# EAGLE design uv-dosimeter-featherwing-mk-2.1 (EAGLE 7.5.0)
AUTHOR: sean@yak.net
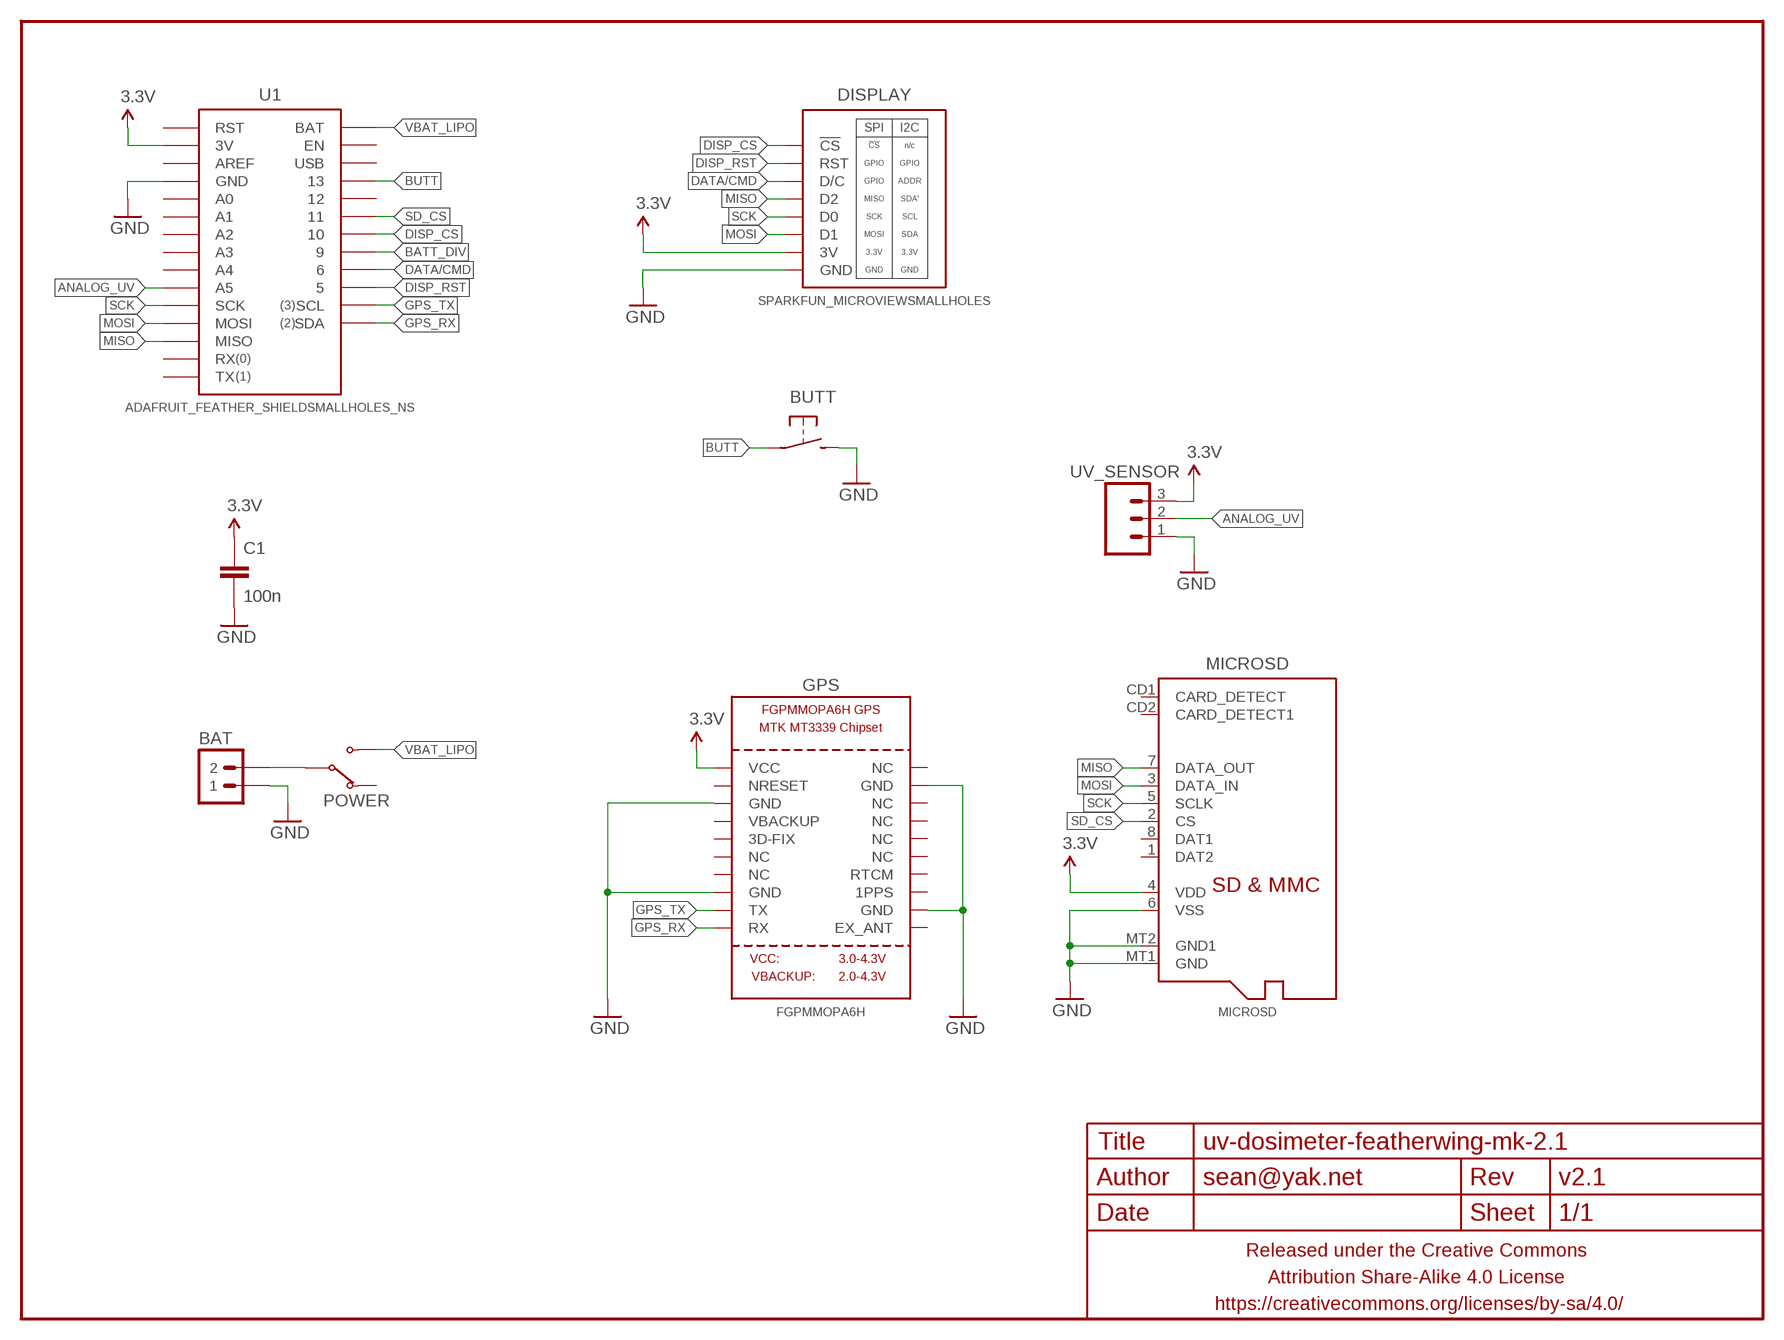
[diagram p0: schematic, sheet 1]

## Parts
BAT  M02JST-2MM-SMT  [JST-2-SMD]
BUTT  SPST-NO-TACT3MM-PTH-SMALL-PADS  [DTS-3-SMALL-PADS]
C1  100n  CAPACITOR-CERAMICC0603  [C0603]
DISPLAY  SPARKFUN_MICROVIEWSMALLHOLES  [SPARKFUN-MICROVIEW-SMALLHOLES]
FRAME1  FRAME-LETTERNO_PACKAGE  [DUMMY]
GPS  FGPMMOPA6H  GPS_FGPMMOPA6H  [FGPMMOPA6H]
MICROSD  MICROSD  [MICROSD]
POWER  SWITCH-SPDTPTH-VERT-2.54MM  [SWITCH-SPDT]
U1  ADAFRUIT_FEATHER_SHIELDSMALLHOLES_NS  [ADAFRUIT_FEATHER_SMALLHOLES_NS]
UV_SENSOR  M03PTH-CENTERED  [1X03-CENTERED]

## Nets
3.3V: C1.1 DISPLAY.3V GPS.P$1(VCC) MICROSD.4(VDD) U1.3V UV_SENSOR.3
ANALOG_UV: U1.A5 UV_SENSOR.2
BATT_DIV: U1.9
BUTT: BUTT.1 U1.13
DATA/CMD: DISPLAY.D/C U1.6
DISP_CS: DISPLAY.CS(!CS) U1.10
DISP_RST: DISPLAY.RST U1.5
GND: BAT.2 BUTT.2 C1.2 DISPLAY.GND GPS.P$3(GND) GPS.P$8(GND) GPS.P$12(GND) GPS.P$19(GND) MICROSD.6(VSS) MICROSD.MT1(GND) MICROSD.MT2(GND1) U1.GND@0(GND) U1.GND@1(GND) UV_SENSOR.1
GPS_RX: GPS.P$10(RX) U1.SDA
GPS_TX: GPS.P$9(TX) U1.SCL
MISO: DISPLAY.D2 MICROSD.7(DATA_OUT) U1.MISO
MOSI: DISPLAY.D1 MICROSD.3(DATA_IN) U1.MOSI
N$2: BAT.1 POWER.2(COM)
SCK: DISPLAY.D0 MICROSD.5(SCLK) U1.SCK
SD_CS: MICROSD.2(CS) U1.11
VBAT_LIPO: POWER.3(NO) U1.BAT
Unconnected: GPS.P$2(NRESET) GPS.P$4(VBACKUP) GPS.P$5(3D-FIX) GPS.P$6(NC) GPS.P$7(NC) GPS.P$11(EX_ANT) GPS.P$13(1PPS) GPS.P$14(RTCM) GPS.P$15(NC) GPS.P$16(NC) GPS.P$17(NC) GPS.P$18(NC) GPS.P$20(NC) MICROSD.1(DAT2) MICROSD.8(DAT1) MICROSD.CD1(CARD_DETECT) MICROSD.CD2(CARD_DETECT1) POWER.1(NC) U1.12 U1.A0 U1.A1 U1.A2 U1.A3 U1.A4 U1.AREF U1.EN U1.RST U1.RX U1.TX U1.USB

## Library data of the parts
BAT = a_parts:M02: Standard 2-pin 0.1" header. Use with - straight break away headers ( PRT-00116) - right angle break away headers (PRT-00553) - swiss pins (PRT-00743) - machine pins (PRT-00117) - female headers (PRT-00115) Molex polarized connector foot print use with: PRT-08233 with associated crimp pins and housings. 2.54_SCREWTERM for use with PRT-10571. 3.5mm Screw Terminal footprints for PRT-08084 5mm Screw Terminal footprints for use with PRT-08433; PROD_ID: CONN-08352
BUTT = a_parts:SPST-NO-TACT
C1 = a_parts:CAPACITOR-CERAMIC: CAPACITOR, European symbol
DISPLAY = a_parts:SPARKFUN_MICROVIEW
FRAME1 = A_butts:FRAME-LETTER: Schematic Frame Standard 8.5x11 US Letter frame; DESIGNER: sean@yak.net; VERSION: v2.1
GPS = a_parts:GPS_FGPMMOPA6H: GPS Module - MTK MT3339 Chipset, -165dBm sensitivity, 22 channels, 10Hz, auto-select external antenna options
MICROSD = a_parts:MICROSD: Micro-SD / Transflash card holder with SPI pinout For the 3M # 2908-05WB-MG and/or 4UCON #19656 push-push type
POWER = a_parts:SWITCH-SPDT
U1 = a_parts:ADAFRUIT_FEATHER_SHIELD
UV_SENSOR = a_parts:M03: Header 3 Standard 3-pin 0.1" header. Use with straight break away headers (SKU : PRT-00116), right angle break away headers (PRT-00553), swiss pins (PRT-00743), machine pins (PRT-00117), and female headers (PRT-00115). Molex polarized connector foot print use with SKU : PRT-08232 with associated crimp pins and housings.

## Board
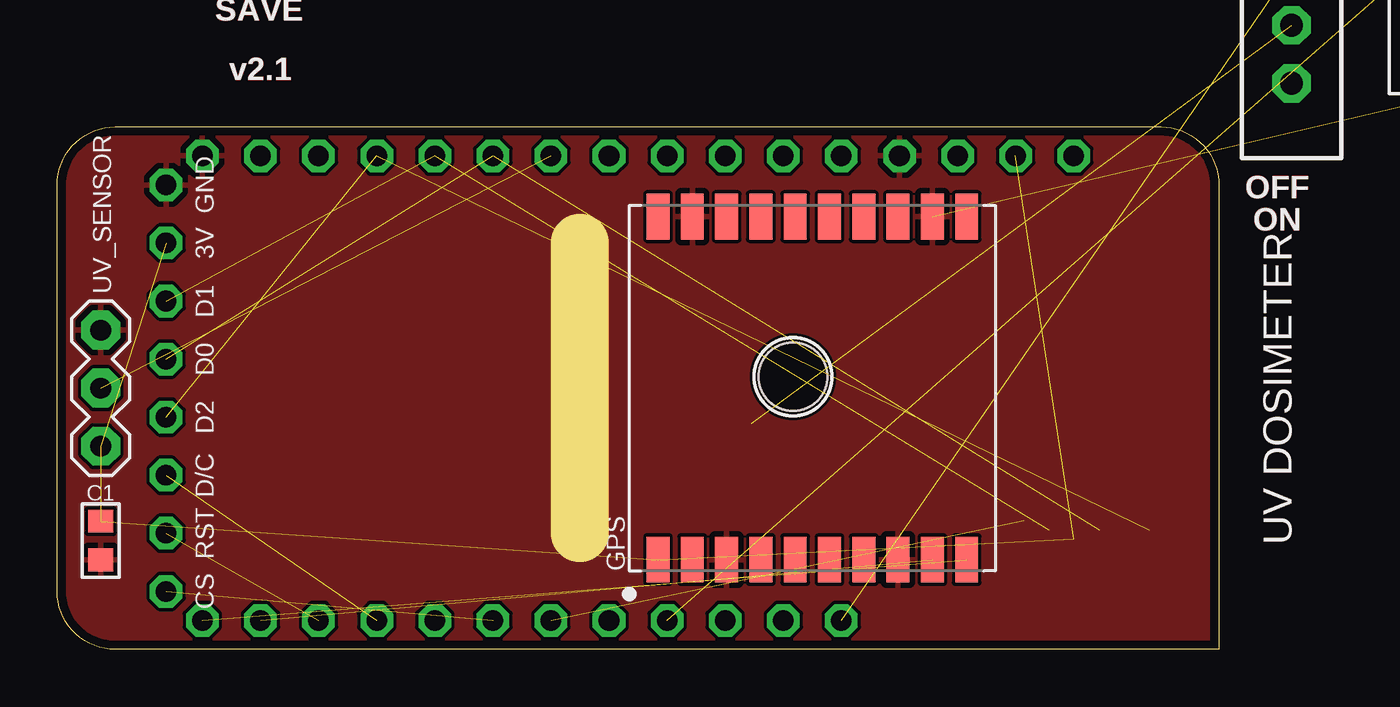
[diagram p1: board, top side]
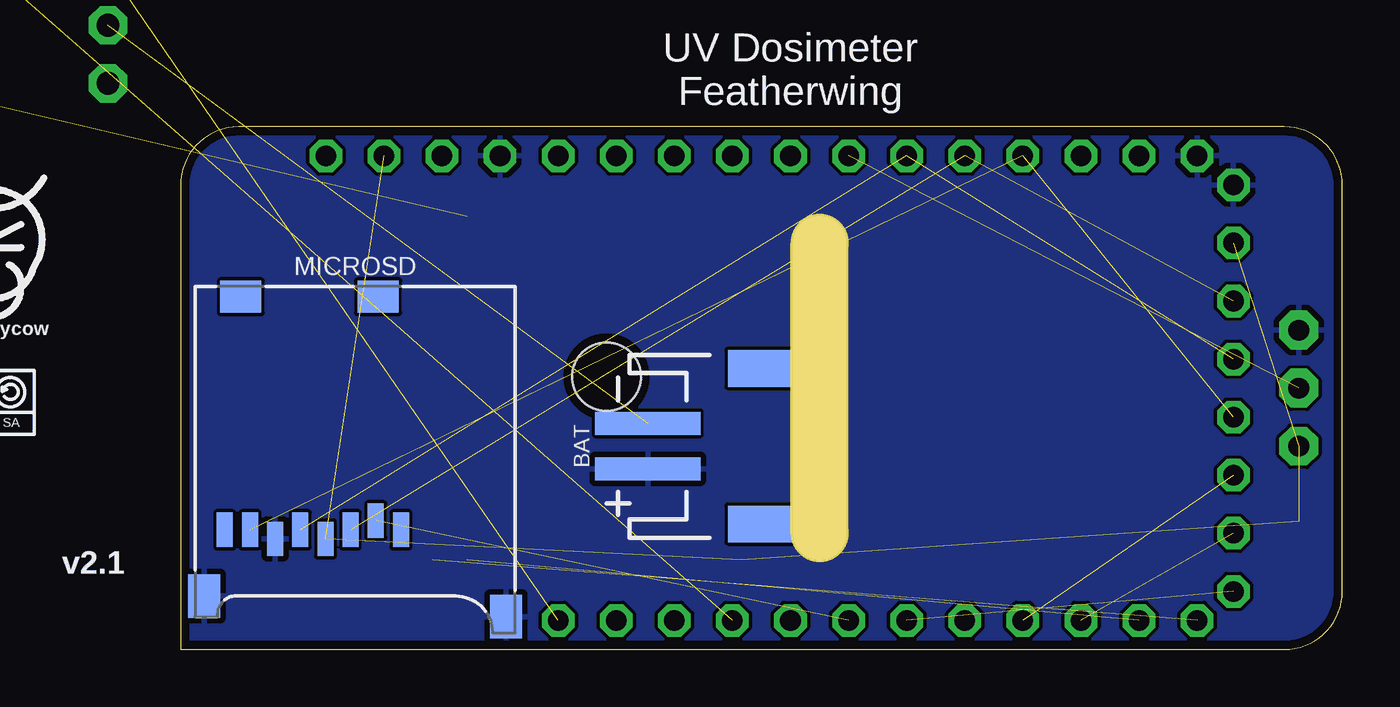
[diagram p2: board, bottom side, seen from below]

Size 50.8 x 22.86 mm. Coordinates in mm from the lower left corner, seen from the top.
Outline: 50.8,20.32 50.8,0 2.54,0 arc-90 0,2.54 0,20.32 arc-90 2.54,22.86 48.26,22.86 arc-90 50.8,20.32
Copper layers (1*16): Top 0.0356mm / dielectric 1.5011mm / Bottom 0.0356mm
Design rules "LaenPCBOrder_2": minimum track width 6mil, minimum drill 13mil, track to track 6mil, track to pad 6mil, pad to pad 6mil, via to via 6mil, smd to smd 6mil, copper to edge 15mil, drill to drill 6mil, minimum pad ring 7mil, minimum via ring 7mil, stop-mask expansion 3mil, vias tented up to drill 20mil, thermal gap 10mil
Milling: 1 lines

### Footprints (pad centres in the part's own frame; a part is rotated, then mirrored left to right if it is on the bottom)
JST-2-SMD = smd 1 x 4.6: 1 -1,-3.7; 2 1,-3.7 | smd 1.6 x 3.4: NC1 -3.4,1.5; NC2 3.4,1.5
DTS-3-SMALL-PADS = drill 1.3 pad 2: 1 -3.25,0; 2 3.25,0
C0603 = smd 1 x 1.1: 1 -0.85,0; 2 0.85,0
SPARKFUN-MICROVIEW-SMALLHOLES = drill 0.9 pad 1.422 octagon: 3V 6.35,8.89; CS -8.89,8.89; D0 1.27,8.89; D1 3.81,8.89; D2 -1.27,8.89; D/C -3.81,8.89; GND 8.89,8.89; RST -6.35,8.89
FGPMMOPA6H = smd 2 x 1: P$1 -7.5,6.75; P$2 -7.5,5.25; P$3 -7.5,3.75; P$4 -7.5,2.25; P$5 -7.5,0.75; P$6 -7.5,-0.75; P$7 -7.5,-2.25; P$8 -7.5,-3.75; P$9 -7.5,-5.25; P$10 -7.5,-6.75; P$11 7.5,-6.75; P$12 7.5,-5.25; P$13 7.5,-3.75; P$14 7.5,-2.25; P$15 7.5,-0.75; P$16 7.5,0.75; P$17 7.5,2.25; P$18 7.5,3.75; P$19 7.5,5.25; P$20 7.5,6.75 | hole 3: 0.5,0.85
MICROSD = smd 0.7 x 1.5: 1 9,-10.64; 2 7.9,-10.24; 3 6.8,-10.64; 4 5.7,-11.04; 5 4.6,-10.64; 6 3.5,-11.04; 7 2.4,-10.64; 8 1.3,-10.64 | smd 1.8 x 1.4: CD1 2,-0.44; CD2 8,-0.44 | smd 1.4 x 1.9: MT1 0.4,-13.54; MT2 13.6,-14.44
SWITCH-SPDT = drill 1 pad 1.676 octagon: 1 0,2.54; 2 0,0; 3 0,-2.54
ADAFRUIT_FEATHER_SMALLHOLES_NS = drill 0.9 pad 1.422 octagon: 3V -16.51,-10.16; 5 13.97,10.16; 6 11.43,10.16; 9 8.89,10.16; 10 6.35,10.16; 11 3.81,10.16; 12 1.27,10.16; 13 -1.27,10.16; A0 -8.89,-10.16; A1 -6.35,-10.16; A2 -3.81,-10.16; A3 -1.27,-10.16; A4 1.27,-10.16; A5 3.81,-10.16; AREF -13.97,-10.16; BAT -8.89,10.16; EN -6.35,10.16; GND@0 -11.43,-10.16; GND@1 19.05,-10.16; MISO 11.43,-10.16; MOSI 8.89,-10.16; RST -19.05,-10.16; RX 13.97,-10.16; SCK 6.35,-10.16; SCL 16.51,10.16; SDA 19.05,10.16; TX 16.51,-10.16; USB -3.81,10.16
1X03-CENTERED = drill 0.9 pad 1.7 octagon: 1 -2.54,0; 2 0,0; 3 2.54,0

### Placement (x,y rotation side)
BAT  26.67,8.89 270 bottom
BUTT  60.01,27.3 270 top  (outside the outline)
C1  1.91,4.76 270 top
DISPLAY  13.65,11.43 90 top
FRAME1  0,0 90 bottom
GPS  33.02,11.43 90 top
MICROSD  50.16,15.88 0 bottom
POWER  53.98,27.3 180 top  (outside the outline)
U1  25.4,11.43 180 top
U$1  [COW_SMALL]  59.05,18.1 0 bottom  (outside the outline)
U$5  [CC-BY-SA-4.0-NO-URL]  60.01,10.79 0 bottom  (outside the outline)
UV_SENSOR  1.91,11.43 270 top

### Tracks (layer width: path | path; a pad name or v marks a point on that pad's centre or on a via)
3.3V  (5 unrouted)
ANALOG_UV  (1 unrouted)
BUTT  (1 unrouted)
DATA/CMD  (1 unrouted)
DISP_CS  (1 unrouted)
DISP_RST  (1 unrouted)
GND  (1 unrouted)
  pour Top (rank 6): 50.8,20.32 50.8,0 2.54,0 arc-90 0,2.54 0,20.32 arc-90 2.54,22.86 48.26,22.86 arc-90
  pour Bottom (rank 6): 50.8,20.32 50.8,0 2.54,0 arc-90 0,2.54 0,20.32 arc-90 2.54,22.86 48.26,22.86 arc-90
GPS_RX  (1 unrouted)
GPS_TX  (1 unrouted)
MISO  (2 unrouted)
MOSI  (2 unrouted)
N$2  (1 unrouted)
SCK  (2 unrouted)
SD_CS  (1 unrouted)
VBAT_LIPO  (1 unrouted)

### Text on the board
Top: SAVE | OFF | ON
tPlace: SAVE | OFF | ON | UV DOSIMETER
bPlace: UV Dosimeter / Featherwing | by schizobovine / <sean@yak.net>